# EAGLE design LEDBatterychargeIndicatorCircuitV2 (EAGLE 9.4.2)
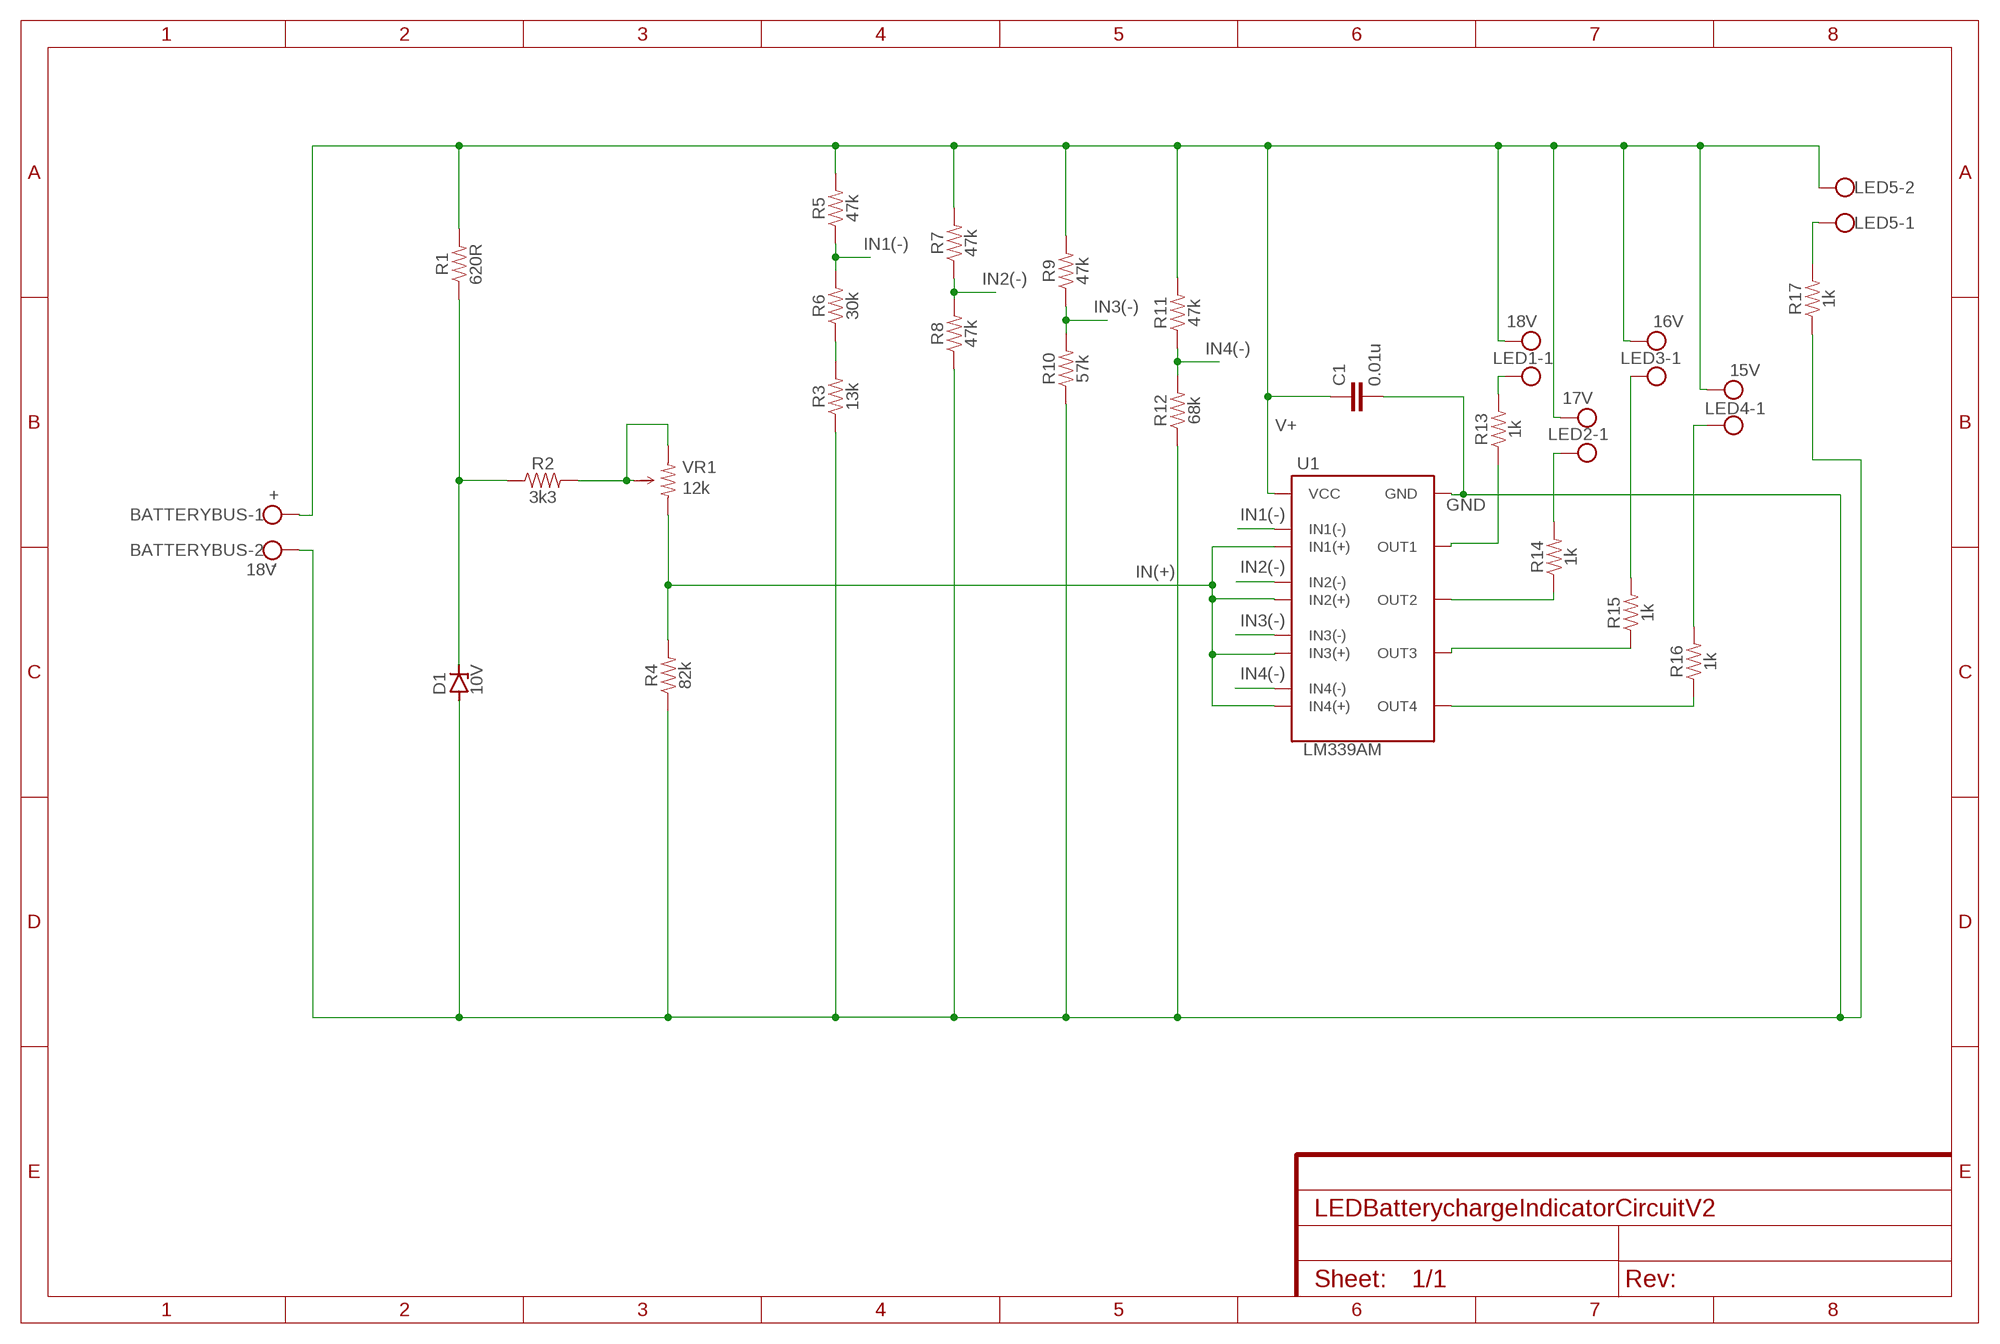
[diagram p0: schematic, sheet 1]

## Parts
BATTERYBUS  18V  W237-102  [W237-102]
C1  0.01u  0.33UF/330NF-0805-50V-10%  [0805]
D1  10V  ZENER-DIODESOT23  [SOT23]
LED1  18V  W237-102  [W237-102]
LED2  17V  W237-102  [W237-102]
LED3  16V  W237-102  [W237-102]
LED4  15V  W237-102  [W237-102]
LED5  W237-102  [W237-102]
R1  620R  RESISTOR0805  [0805]
R2  3k3  RESISTOR0805  [0805]
R3  13k  RESISTOR0805  [0805]
R4  82k  RESISTOR0805  [0805]
R5  47k  RESISTOR0805  [0805]
R6  30k  RESISTOR0805  [0805]
R7  47k  RESISTOR0805  [0805]
R8  47k  RESISTOR0805  [0805]
R9  47k  RESISTOR0805  [0805]
R10  57k  RESISTOR0805  [0805]
R11  47k  RESISTOR0805  [0805]
R12  68k  RESISTOR0805  [0805]
R13  1k  RESISTOR0805  [0805]
R14  1k  RESISTOR0805  [0805]
R15  1k  RESISTOR0805  [0805]
R16  1k  RESISTOR0805  [0805]
R17  1k  RESISTOR0805  [0805]
U1  LM339AM  LM339AMSMD  [LM339AM]
VR1  12k  TRIMPOT3266W  [TRIMPOT3266W]

## Nets
GND: BATTERYBUS.2 C1.2 D1.1(A) R3.1 R4.1 R8.1 R10.1 R12.1 R17.1 U1.12(GND)
IN1(-): R5.1 R6.2 U1.4(IN1(-))
IN2(-): R7.1 R8.2 U1.6(IN2(-))
IN3(-): R9.1 R10.2 U1.8(IN3(-))
IN4(-): R11.1 R12.2 U1.10(IN4(-))
IN(+): R4.2 U1.5(IN1(+)) U1.7(IN2(+)) U1.9(IN3(+)) U1.11(IN4(+)) VR1.1
N$1: LED5.1 R17.2
N$2: LED1.1 R13.2
N$3: R13.1 U1.2(OUT1)
N$4: D1.3(C) R1.1 R2.1
N$5: R14.1 U1.1(OUT2)
N$6: R2.2 VR1.2(WIPER) VR1.3
N$7: LED2.1 R14.2
N$8: LED3.1 R15.2
N$9: R15.1 U1.14(OUT3)
N$10: R16.1 U1.13(OUT4)
N$11: LED4.1 R16.2
N$12: R3.2 R6.1
V+: BATTERYBUS.1 C1.1 LED1.2 LED2.2 LED3.2 LED4.2 LED5.2 R1.2 R5.2 R7.2 R9.2 R11.2 U1.3(VCC)

## Notes on the sheet
- +
- -

## Library data of the parts
BATTERYBUS LED1-LED5 = con-wago-500:W237-102: WAGO SCREW CLAMP; MPN: 237-102; OC_FARNELL: unknown; OC_NEWARK: 70K9898
C1 = SparkFun-Capacitors:0.33UF/330NF: 0.33µF/330nF ceramic capacitors A capacitor is a passive two-terminal electrical component used to store electrical energy temporarily in an electric field.; PROD_ID: CAP-08469; VALUE: 0.33µF
D1 = diode:ZENER-DIODE: Z-Diode
R1-R17 = SparkFun-Resistors:RESISTOR: Generic Resistor Package
U1 = RequiredComponents:LM339AM: The LM339AM is a quad comparator that requires 32V supply (+-18V) with a typical response time of 1.3us
VR1 = RequiredComponents:TRIMPOT3266W

## Board
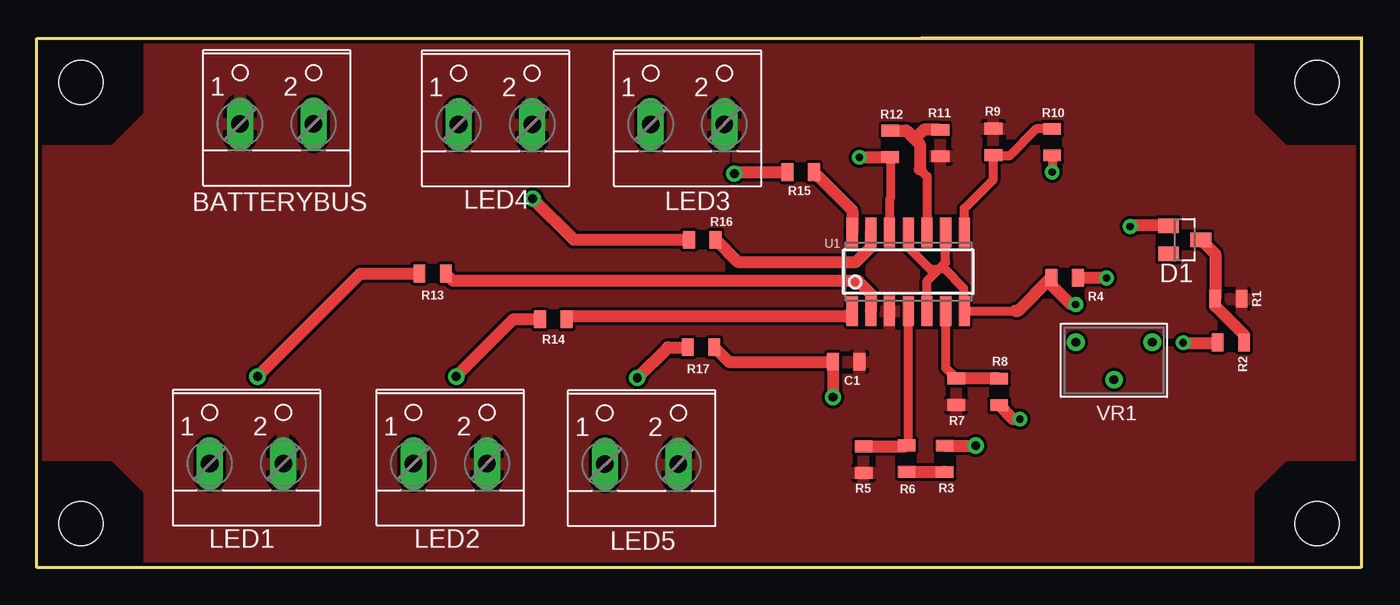
[diagram p1: board, top side]
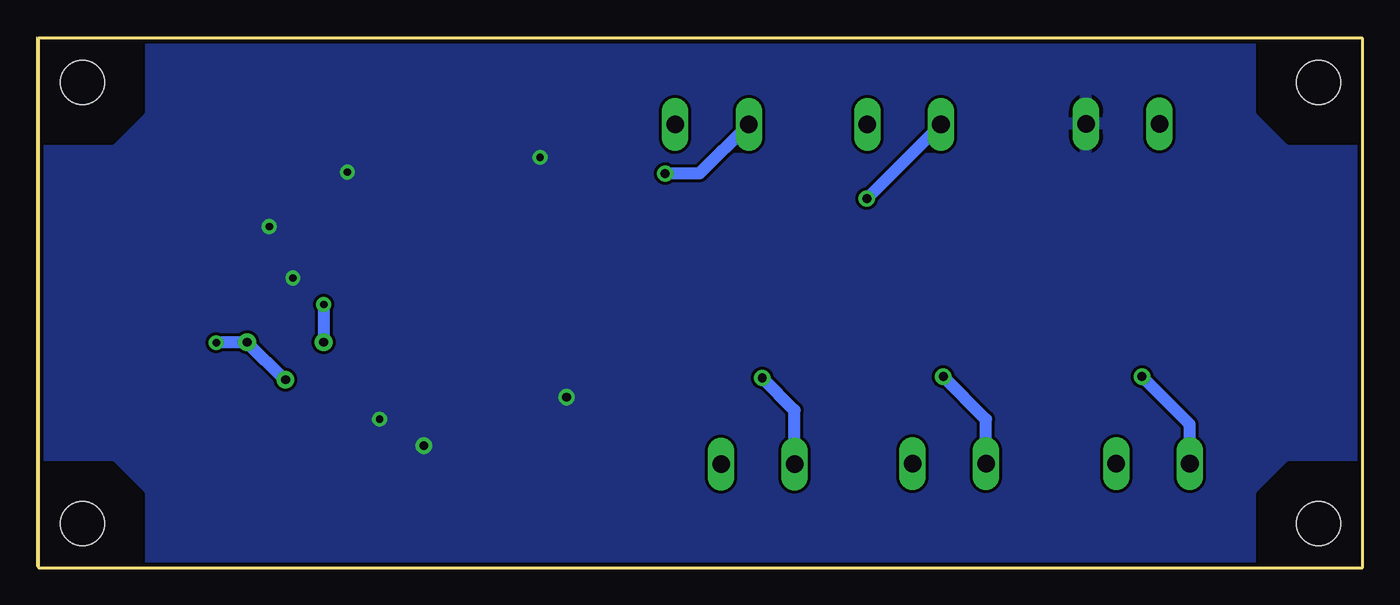
[diagram p2: board, bottom side, seen from below]

Size 90.1 x 36.1 mm. Coordinates in mm from the lower left corner, seen from the top.
Outline: 90,0 90.1,0.1 90.1,36.1 0,36
Outline: 0,36 0,0 90,0
Outline: 0,36 90,36 90,0
Copper layers (1*16): Top 0.035mm / dielectric 1.5mm / Bottom 0.035mm
Design rules "PCBTrain": minimum track width 8mil, minimum drill 0.2mm, track to track 8mil, track to pad 8mil, pad to pad 8mil, via to via 8mil, smd to smd 8mil, copper to edge 0.25mm, drill to drill 8mil, minimum pad ring 12mil, minimum via ring 10mil, stop-mask expansion 4mil, vias tented up to drill 20mil, thermal gap 10mil
Holes 3 mm at 3,33 3,3 87,3 87,33
tRestrict: 12 lines
bRestrict: 12 lines

### Footprints (pad centres in the part's own frame; a part is rotated, then mirrored left to right if it is on the bottom)
W237-102 = drill 1.194 long: 1 -2.5,-1.27; 2 2.5,-1.27
0805 = smd 0.8 x 1.2: 1 -0.9,0; 2 0.9,0
SOT23 = smd 1 x 1.4: 1 -0.95,-1.1; 2 0.95,-1.1; 3 0,1.1
LM339AM = smd 0.75 x 2.04: 1 -3.81,-2.66; 2 -2.54,-2.66; 3 -1.27,-2.66; 4 0,-2.66; 5 1.27,-2.66; 6 2.54,-2.66; 7 3.81,-2.66; 8 3.81,2.66; 9 2.54,2.66; 10 1.27,2.66; 11 0,2.66; 12 -1.27,2.66; 13 -2.54,2.66; 14 -3.81,2.66
TRIMPOT3266W = drill 0.6: 1 -2.595,1.23; 2 0,-1.31; 3 2.595,1.23

### Placement (x,y rotation side)
BATTERYBUS  16.31,31.45 0 top
C1  55,14 180 top
D1  78,22.3 270 top
LED1  14.25,8.35 0 top
LED2  28.09,8.35 0 top
LED3  44.22,31.41 0 top
LED4  31.16,31.41 0 top
LED5  41.1,8.31 0 top
R1  80.97,18.28 0 top
R2  81.14,15.32 180 top
R3  61.7,7.4 270 top
R4  69.85,19.72 180 top
R5  56.18,7.36 270 top
R6  59.12,7.43 90 top
R7  62.48,11.98 270 top
R8  65.4,11.96 90 top
R9  65,28.95 90 top
R10  69,28.94 90 top
R11  61.4,28.87 270 top
R12  58,28.82 90 top
R13  26.89,20 180 top
R14  35.1,16.9 180 top
R15  51.91,26.9 180 top
R16  45.22,22.3 180 top
R17  45.14,14.99 180 top
U1  59.22,20.13 0 top
VR1  73.2,14.1 0 top

### Tracks (layer width: path | path; a pad name or v marks a point on that pad's centre or on a via)
GND  (via drill 0.5, 0.6)
  Top 0.61: U1.12 57.95,25.05 58,25.1 R12.1 | R10.1 v69,26.9
  Top 0.813: v66.8,10.1 66.36,10.1 R8.1 | v55.9,27.9 55.92,27.92 R12.1 | R4.1 72.68,19.72 v72.7,19.7 | D1.1 74.35,23.25 v74.3,23.2 | R17.1 47.03,14 C1.2 v54.1,11.6 | R3.1 v63.8,8.3
  pour Bottom: 0,36 90,36 90,0 0,0
IN1(-)
  Top 0.61: R6.2 59.22,8.43 U1.4
  Top 0.813: R5.1 59.05,8.26 R6.2
IN2(-)
  Top 0.61: U1.6 61.76,13.6 R7.1
  Top 0.813: R8.2 62.9,12.86 62.88,12.88 R7.1
IN3(-)
  Top 0.61: U1.8 63.03,24.43 65,26.4 R9.1 65.05,28 66.1,28 67.94,29.84 R10.2
IN4(-)
  Top 0.61: U1.10 60.49,26.61 60,27.1
  Top 0.813: R12.2 59.08,29.72 59.65,29.15 | 60,27.1 60,28.8 59.65,29.15 | R11.1 60.27,29.77 59.65,29.15
IN(+)  (via drill 0.5)
  Top 0.61: U1.5 60.49,19.49 61.3,20.3 | U1.9 61.76,20.76 61.3,20.3 | 66.47,17.47 U1.7 63,17.5 63,19 61.7,20.3 61.3,20.3 | U1.11 59.22,21.78 60.7,20.3 61.3,20.3
  Top 0.813: 66.47,17.47 66.7,17.47 R4.2 68.95,19.22 70.27,17.9 v70.6,17.9
  Bottom 0.813: v70.6,17.9 VR1.1
N$1  (via drill 0.6)
  Top 0.813: v40.8,12.9 42.89,14.99 R17.2
  Bottom 0.813: LED5.1 38.6,10.7 v40.8,12.9
N$2  (via drill 0.6)
  Top 0.813: v15,13 22,20 R13.2
  Bottom 0.813: LED1.1 11.75,9.75 v15,13
N$3
  Top 0.813: R13.1 28.29,19.5 55.8,19.5 56.68,18.62 U1.2
N$4
  Top 0.813: R2.1 82.04,15.81 80.07,17.78 R1.1 80.07,21.33 D1.3
N$5
  Top 0.813: R14.1 36.17,17.07 55.01,17.07 U1.1
N$6  (via drill 0.5)
  Top 0.813: v77.9,15.3 80.22,15.3 R2.2
  Bottom 0.813: VR1.2 73.25,12.79 VR1.3 77.87,15.33 v77.9,15.3
N$7  (via drill 0.6)
  Top 0.813: v28.5,13 32.4,16.9 R14.2
  Bottom 0.813: LED2.1 25.59,10.09 v28.5,13
N$8  (via drill 0.6)
  Top 0.813: v47.4,26.8 47.5,26.9 R15.2
  Bottom 0.813: LED3.1 45.06,26.8 v47.4,26.8
N$9
  Top 0.813: R15.1 55.41,24.3 U1.14
N$10
  Top 0.813: R16.1 47.62,20.8 55.68,20.8 56.68,21.8 U1.13
N$11  (via drill 0.6)
  Top 0.813: v33.7,25.1 36.5,22.3 R16.2
  Bottom 0.813: LED4.1 v33.7,25.1
N$12
  Top 0.813: R6.1 61.67,6.53 R3.2
V+
  pour Top: 0,36 90,36 90,0 0,0

### Text on the board
tPlace: VR1